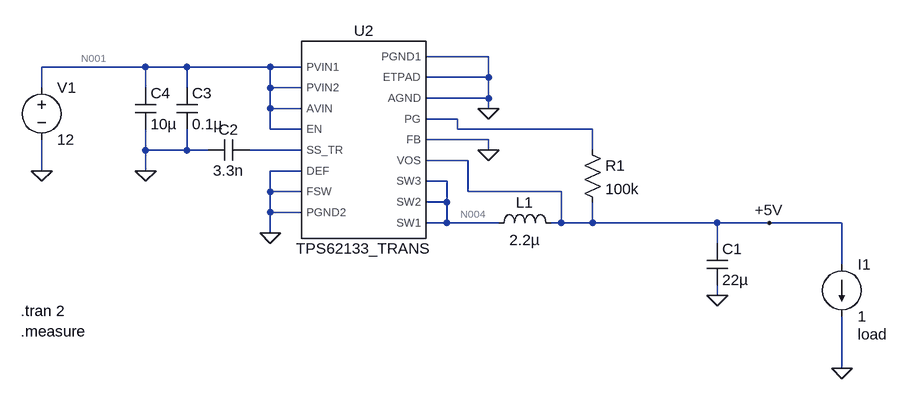
[diagram p0: schematic 5V_Buck.asc]
5V_Buck.asc, the LTspice schematic file:
Version 4.1
SHEET 1 1004 744
WIRE 384 48 288 48
WIRE -144 64 -304 64
WIRE -80 64 -144 64
WIRE 48 64 -80 64
WIRE 96 64 48 64
WIRE 384 80 384 48
WIRE 384 80 288 80
WIRE -304 96 -304 64
WIRE -144 96 -144 64
WIRE -80 96 -80 64
WIRE 48 96 48 64
WIRE 96 96 48 96
WIRE 384 112 384 80
WIRE 384 112 288 112
WIRE 48 128 48 96
WIRE 96 128 48 128
WIRE 384 128 384 112
WIRE 336 144 288 144
WIRE 48 160 48 128
WIRE 96 160 48 160
WIRE 336 160 336 144
WIRE 544 160 336 160
WIRE 384 176 288 176
WIRE -144 192 -144 160
WIRE -80 192 -80 160
WIRE -80 192 -144 192
WIRE -48 192 -80 192
WIRE 96 192 16 192
WIRE 384 192 384 176
WIRE 544 192 544 160
WIRE 352 208 288 208
WIRE -304 224 -304 176
WIRE -144 224 -144 192
WIRE 96 224 48 224
WIRE 320 240 288 240
WIRE 48 256 48 224
WIRE 96 256 48 256
WIRE 352 256 352 208
WIRE 496 256 352 256
WIRE 320 272 320 240
WIRE 320 272 288 272
WIRE 48 288 48 256
WIRE 96 288 48 288
WIRE 320 304 320 272
WIRE 320 304 288 304
WIRE 400 304 320 304
WIRE 496 304 496 256
WIRE 496 304 480 304
WIRE 544 304 544 272
WIRE 544 304 496 304
WIRE 736 304 544 304
WIRE 816 304 736 304
WIRE 928 304 816 304
WIRE 48 320 48 288
WIRE 736 336 736 304
WIRE 928 368 928 304
WIRE 736 416 736 400
WIRE 928 528 928 448
FLAG -304 224 0
FLAG 384 128 0
FLAG 384 192 0
FLAG 816 304 +5V
FLAG 736 416 0
FLAG -144 224 0
FLAG 48 320 0
FLAG 928 528 0
SYMBOL voltage -304 80 R0
WINDOW 123 0 0 Left 0
WINDOW 39 0 0 Left 0
SYMATTR InstName V1
SYMATTR Value 12
SYMBOL ind 384 320 R270
WINDOW 0 32 56 VTop 2
WINDOW 3 5 56 VBottom 2
SYMATTR InstName L1
SYMATTR Value 2.2µ
SYMBOL res 528 176 R0
SYMATTR InstName R1
SYMATTR Value 100k
SYMBOL cap 720 336 R0
SYMATTR InstName C1
SYMATTR Value 22µ
SYMBOL cap 16 176 R90
WINDOW 0 0 32 VBottom 2
WINDOW 3 32 32 VTop 2
SYMATTR InstName C2
SYMATTR Value 3.3n
SYMBOL cap -96 96 R0
SYMATTR InstName C3
SYMATTR Value 0.1µ
SYMBOL cap -160 96 R0
SYMATTR InstName C4
SYMATTR Value 10µ
SYMBOL current 928 368 R0
WINDOW 123 0 0 Left 0
WINDOW 39 24 108 Left 2
SYMATTR InstName I1
SYMATTR Value 1
SYMATTR SpiceLine load
SYMBOL TPS62133_PSPICE_TRANS\\TPS62133_TRANS 192 176 R0
SYMATTR InstName U2
TEXT -336 440 Left 2 !.tran 2\n.measure

The netlist it stands for:
* 5V_Buck.asc
V1 N001 0 12
L1 N004 +5V 2.2µ
R1 N002 +5V 100k
C1 +5V 0 22µ
C2 N003 0 3.3n
C3 N001 0 0.1µ
C4 N001 0 10µ
I1 +5V 0 1 load
X§U2 N001 N001 N001 N001 N003 0 0 0 0 0 0 N002 0 +5V N004 N004 N004 TPS62133_TRANS  ; pins PVIN1 PVIN2 AVIN EN SS_TR DEF FSW PGND2 PGND1 ETPAD AGND PG FB VOS SW3 SW2 SW1
.tran 2
.measure
.lib C:\GitHub\MRDT\Electrical\RoveSoCameraServer_Hardware\simulation\TPS62133_PSPICE_TRANS\TPS62133_TRANS.lib
.backanno
.end

* Results of the author's LTspice run, read from the files saved beside the schematic
* Operating Point, zero values left out:
*   V(n004) = 301.2 nV
*   V(n001) = 12 V
*   V(+5v) = 300 nV
*   I(V1) = -20.44 µA
*   I(I1) = 1.2 µA
*   I(R1) = -2.996 pA
*   I(L1) = 1.2 µA
*   Ix(u2:pvin1) = 600 nA
*   Ix(u2:pvin2) = 600 nA
*   Ix(u2:avin) = 19.05 µA
*   Ix(u2:en) = 195 nA
*   Ix(u2:pg) = 2.996 pA
*   Ix(u2:vos) = -7.161 pA
*   Ix(u2:sw3) = -400 nA
*   Ix(u2:sw2) = -400 nA
*   Ix(u2:sw1) = -400 nA